# EAGLE design pixhawkDF13 (EAGLE 7.6.0)

## Sheet 1 of 2
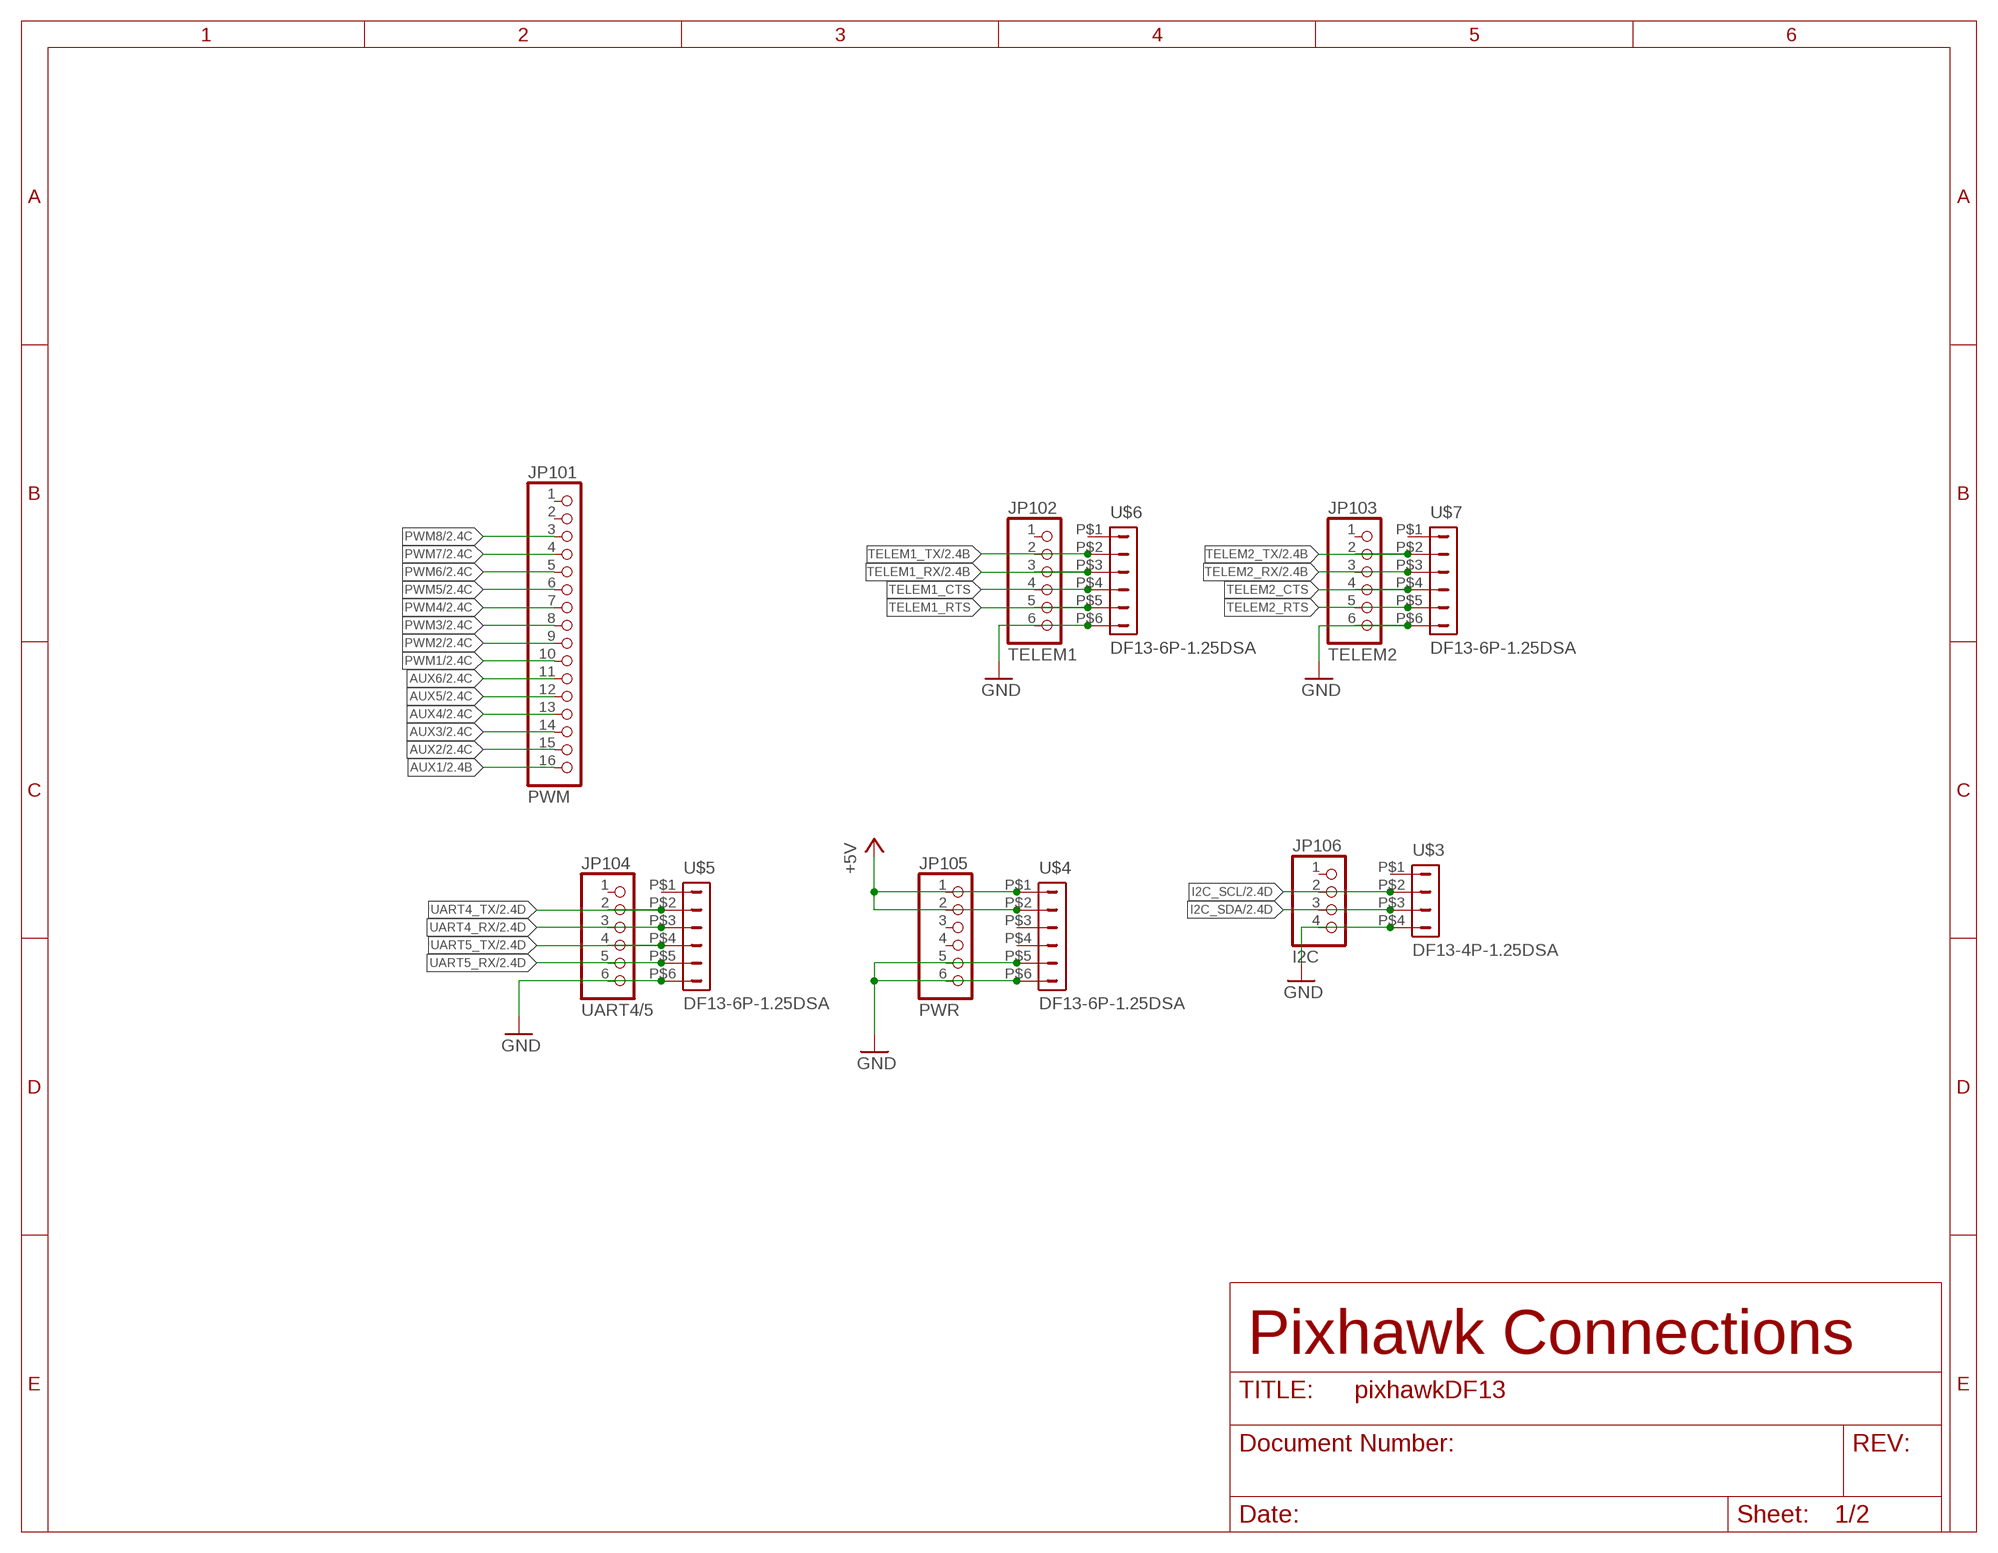
[diagram p0: schematic, sheet 1]

### Parts
JP101  PWM  PINHD-1X16  [1X16]
JP102  TELEM1  PINHD-1X6  [1X06]
JP103  TELEM2  PINHD-1X6  [1X06]
JP104  UART4/5  PINHD-1X6  [1X06]
JP105  PWR  PINHD-1X6  [1X06]
JP106  I2C  PINHD-1X4  [1X04]
U$3  DF13-4P-1.25DSA  [DF13-4P-1.25DSA]
U$4  DF13-6P-1.25DSA  [DF13-6P-1.25DSA]
U$5  DF13-6P-1.25DSA  [DF13-6P-1.25DSA]
U$6  DF13-6P-1.25DSA  [DF13-6P-1.25DSA]
U$7  DF13-6P-1.25DSA  [DF13-6P-1.25DSA]

### Nets
+5V: JP105.1 JP105.2 U$4.P$1 U$4.P$2 ; also sheet 2
AUX1: JP101.16 ; also sheet 2
AUX2: JP101.15 ; also sheet 2
AUX3: JP101.14 ; also sheet 2
AUX4: JP101.13 ; also sheet 2
AUX5: JP101.12 ; also sheet 2
AUX6: JP101.11 ; also sheet 2
GND: JP102.6 JP103.6 JP104.6 JP105.5 JP105.6 JP106.4 U$3.P$4 U$4.P$5 U$4.P$6 U$5.P$6 U$6.P$6 U$7.P$6 ; also sheet 2
I2C_SCL: JP106.2 U$3.P$2 ; also sheet 2
I2C_SDA: JP106.3 U$3.P$3 ; also sheet 2
PWM1: JP101.10 ; also sheet 2
PWM2: JP101.9 ; also sheet 2
PWM3: JP101.8 ; also sheet 2
PWM4: JP101.7 ; also sheet 2
PWM5: JP101.6 ; also sheet 2
PWM6: JP101.5 ; also sheet 2
PWM7: JP101.4 ; also sheet 2
PWM8: JP101.3 ; also sheet 2
TELEM1_CTS: JP102.4 U$6.P$4
TELEM1_RTS: JP102.5 U$6.P$5
TELEM1_RX: JP102.3 U$6.P$3 ; also sheet 2
TELEM1_TX: JP102.2 U$6.P$2 ; also sheet 2
TELEM2_CTS: JP103.4 U$7.P$4
TELEM2_RTS: JP103.5 U$7.P$5
TELEM2_RX: JP103.3 U$7.P$3 ; also sheet 2
TELEM2_TX: JP103.2 U$7.P$2 ; also sheet 2
UART4_RX: JP104.3 U$5.P$3 ; also sheet 2
UART4_TX: JP104.2 U$5.P$2 ; also sheet 2
UART5_RX: JP104.5 U$5.P$5 ; also sheet 2
UART5_TX: JP104.4 U$5.P$4 ; also sheet 2
Unconnected: JP101.1 JP101.2 JP102.1 JP103.1 JP104.1 JP105.3 JP105.4 JP106.1 U$3.P$1 U$4.P$3 U$4.P$4 U$5.P$1 U$6.P$1 U$7.P$1

### Notes on the sheet
- Pixhawk Connections

## Sheet 2 of 2
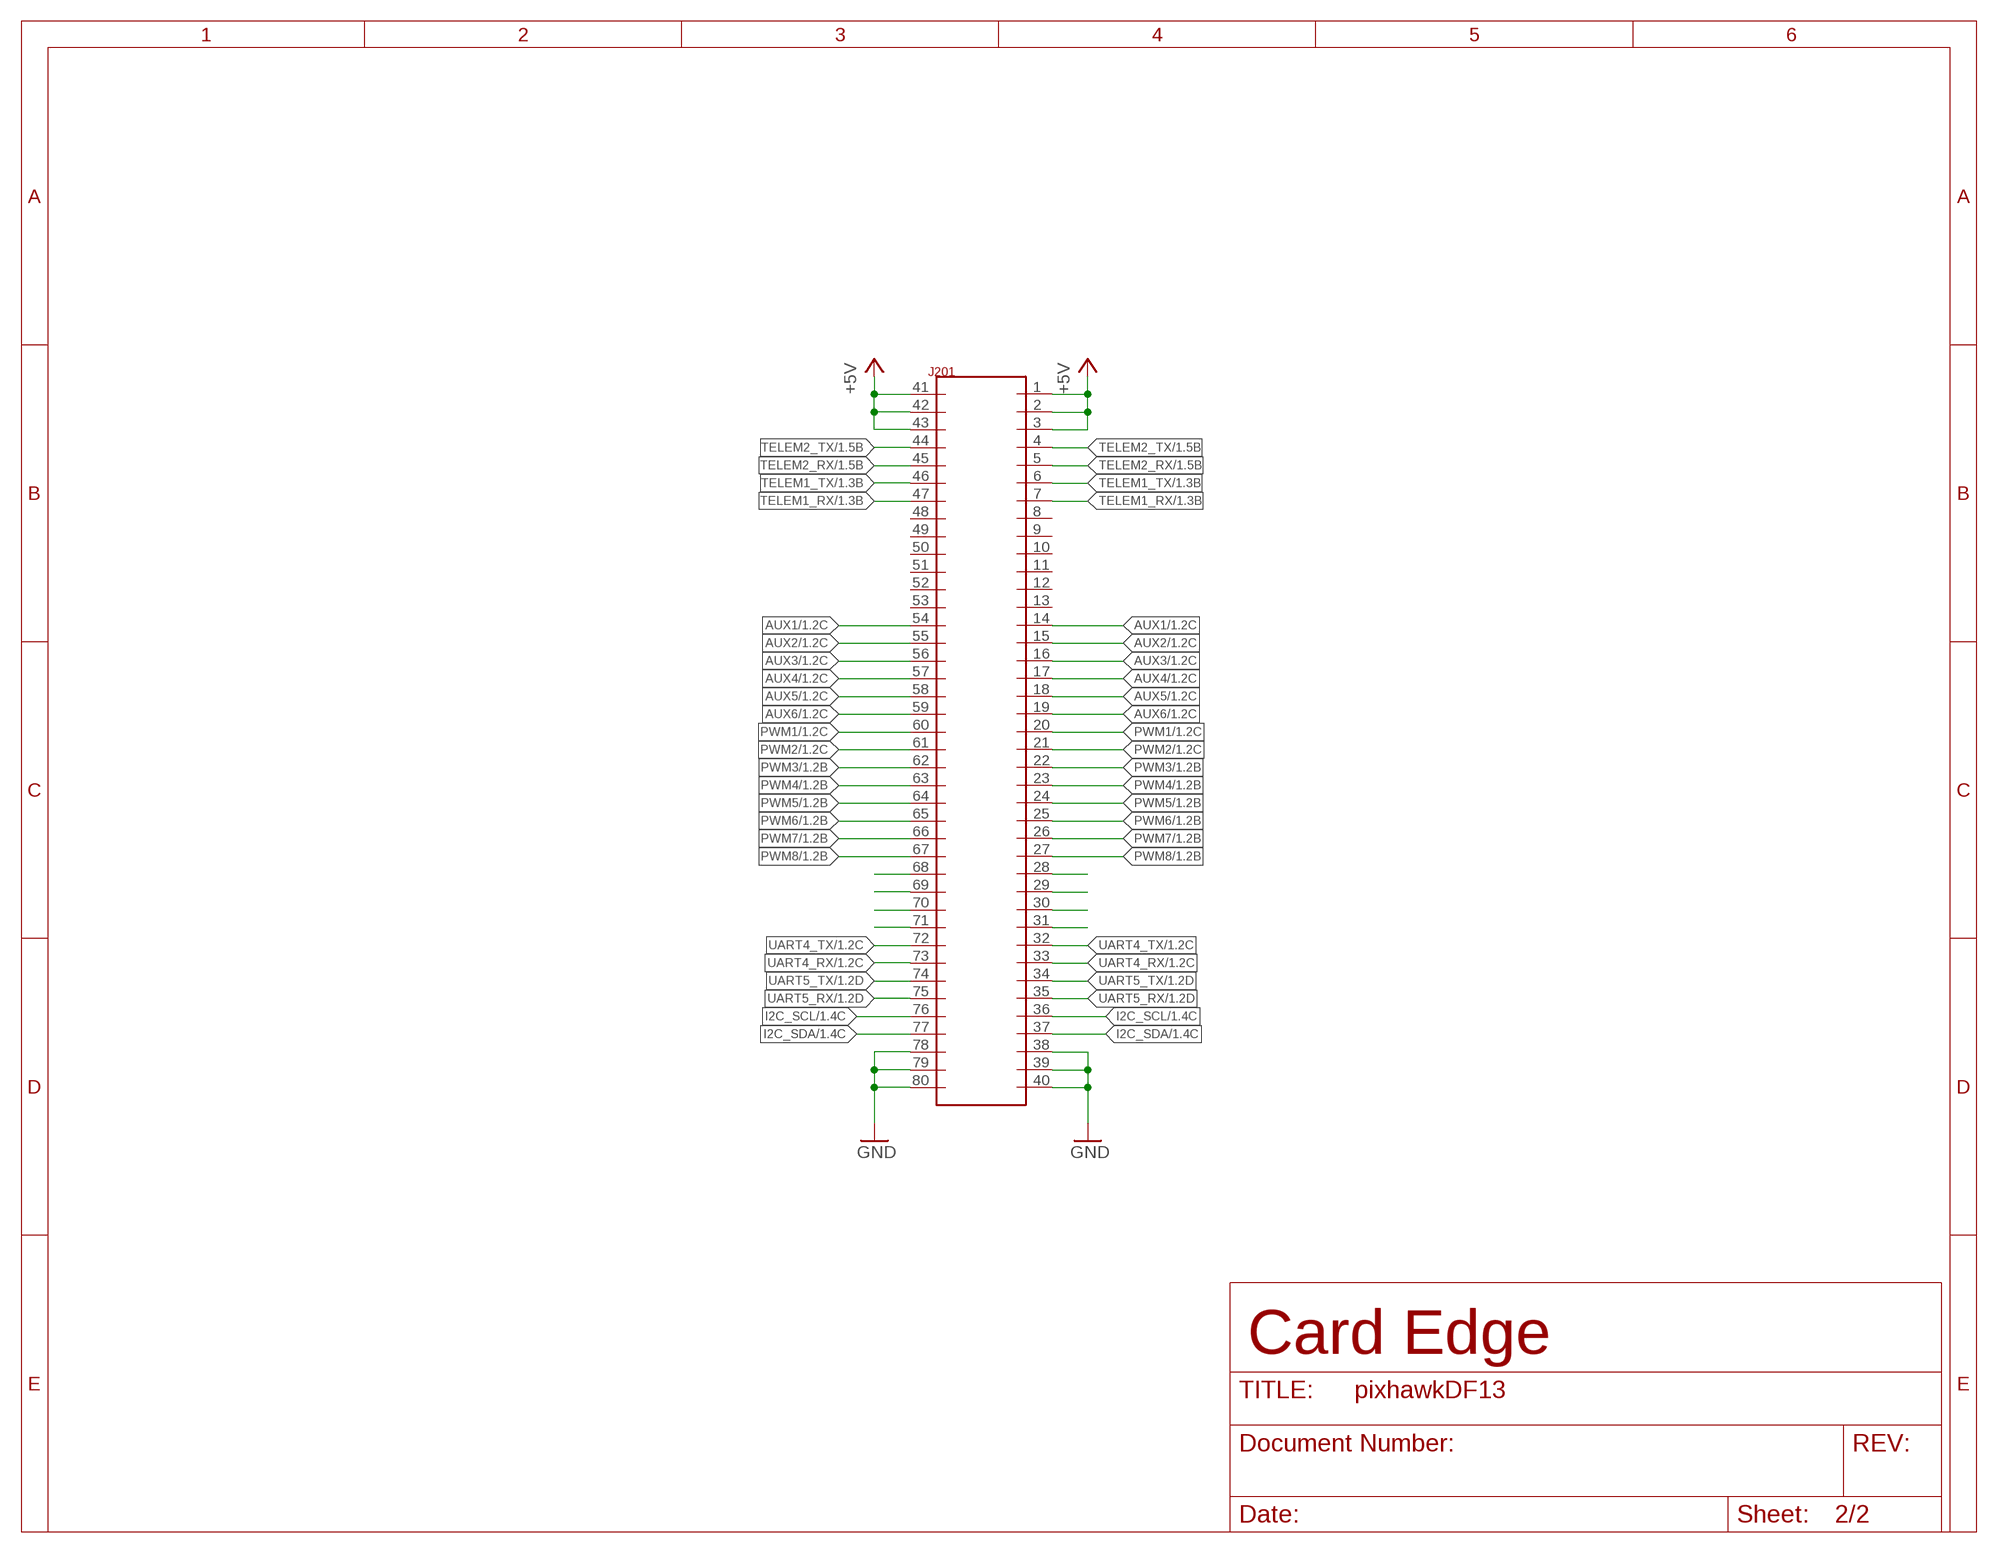
[diagram p1: schematic, sheet 2]

### Parts
J201  80-PIN-CARD-EDGE  [80-PIN-CARD-EDGE]

### Nets
+5V: J201.1 J201.2 J201.3 J201.41 J201.42 J201.43 ; also sheet 1
AUX1: J201.14 J201.54 ; also sheet 1
AUX2: J201.15 J201.55 ; also sheet 1
AUX3: J201.16 J201.56 ; also sheet 1
AUX4: J201.17 J201.57 ; also sheet 1
AUX5: J201.18 J201.58 ; also sheet 1
AUX6: J201.19 J201.59 ; also sheet 1
CAN_H: J201.30 J201.70
CAN_L: J201.31 J201.71
GND: J201.38 J201.39 J201.40 J201.78 J201.79 J201.80 ; also sheet 1
I2C_SCL: J201.36 J201.76 ; also sheet 1
I2C_SDA: J201.37 J201.77 ; also sheet 1
N$11: J201.28
N$12: J201.29
N$25: J201.69
N$26: J201.68
PWM1: J201.20 J201.60 ; also sheet 1
PWM2: J201.21 J201.61 ; also sheet 1
PWM3: J201.22 J201.62 ; also sheet 1
PWM4: J201.23 J201.63 ; also sheet 1
PWM5: J201.24 J201.64 ; also sheet 1
PWM6: J201.25 J201.65 ; also sheet 1
PWM7: J201.26 J201.66 ; also sheet 1
PWM8: J201.27 J201.67 ; also sheet 1
TELEM1_RX: J201.7 J201.47 ; also sheet 1
TELEM1_TX: J201.6 J201.46 ; also sheet 1
TELEM2_RX: J201.5 J201.45 ; also sheet 1
TELEM2_TX: J201.4 J201.44 ; also sheet 1
UART4_RX: J201.33 J201.73 ; also sheet 1
UART4_TX: J201.32 J201.72 ; also sheet 1
UART5_RX: J201.35 J201.75 ; also sheet 1
UART5_TX: J201.34 J201.74 ; also sheet 1
Unconnected: J201.8 J201.9 J201.10 J201.11 J201.12 J201.13 J201.48 J201.49 J201.50 J201.51 J201.52 J201.53

### Notes on the sheet
- Card Edge

## Library data of the parts
J201 = auv:80-PIN-CARD-EDGE
JP101 = auv:PINHD-1X16: PIN HEADER
JP102-JP105 = auv:PINHD-1X6: PIN HEADER
JP106 = auv:PINHD-1X4: PIN HEADER
U$3 = con-hirose-df13:DF13-4P-1.25: DF13-4P 1.25mm Pitch Miniature Crimping Connector.
U$4-U$7 = con-hirose-df13:DF13-6P-1.25: DF13-6P 1.25mm Pitch Miniature Crimping Connector.

## Board
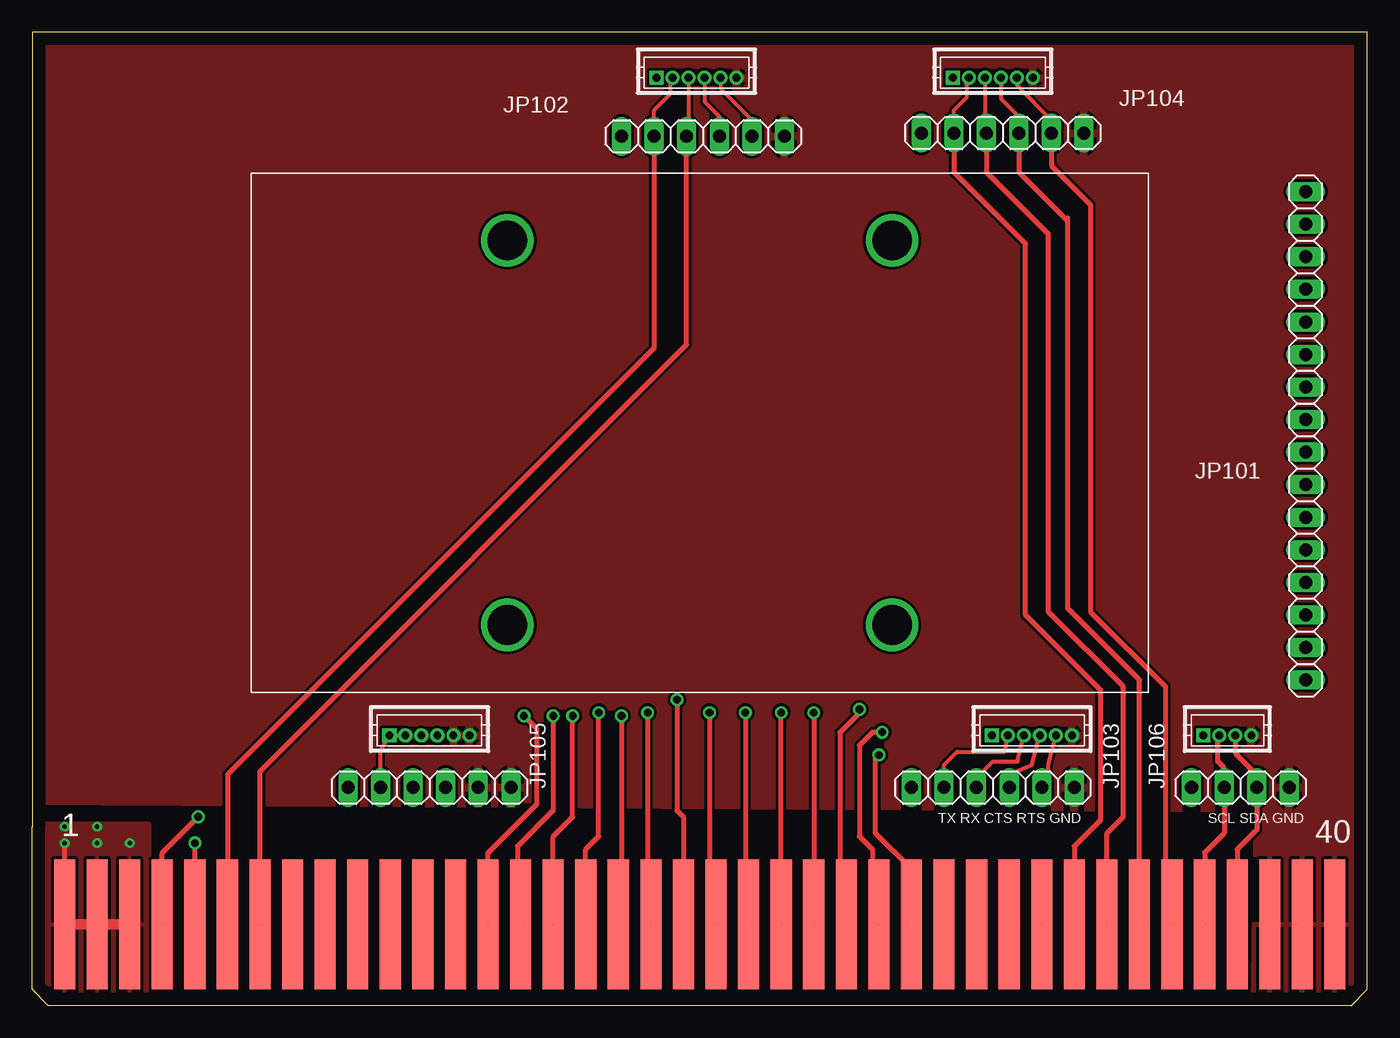
[diagram p2: board, top side]
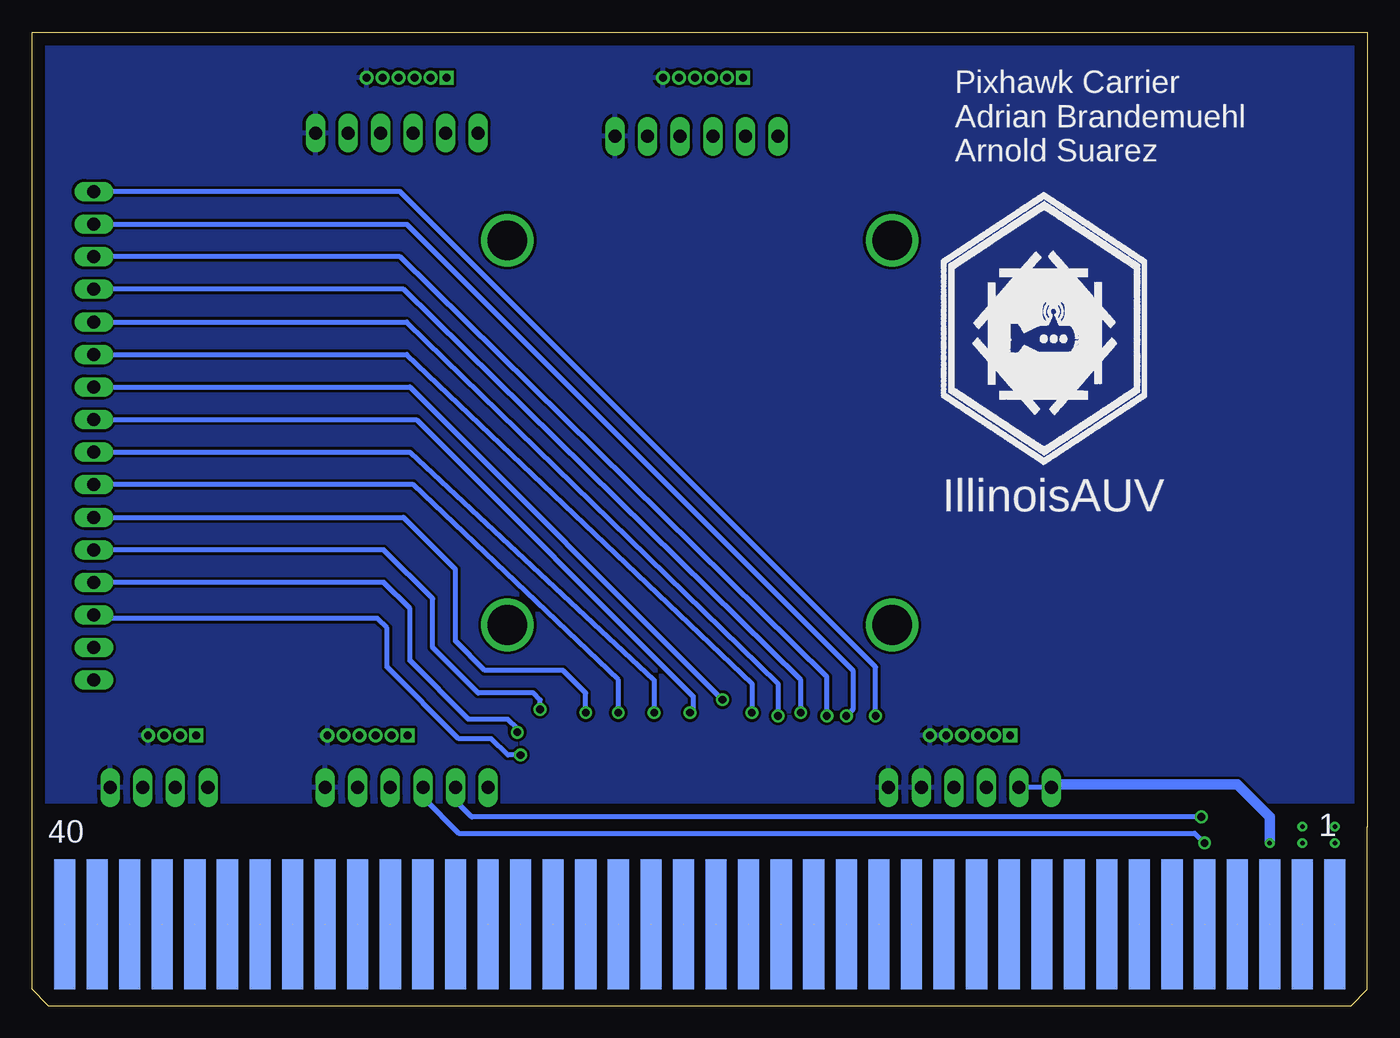
[diagram p3: board, bottom side, seen from below]

Size 104.14 x 75.95 mm. Coordinates in mm from the lower left corner, seen from the top.
Outline: 104.14,13.97 104.14,75.95 0,75.95 0,13.97
Copper layers (1*16): Top 0.035mm / dielectric 1.5mm / Bottom 0.035mm
Design rules "PCBway": minimum track width 6mil, minimum drill 0.3mm, track to track 0.205mm, track to pad 0.205mm, pad to pad 0.205mm, via to via 0.205mm, smd to smd 8mil, copper to edge 40mil, drill to drill 8mil, minimum pad ring 10mil, minimum via ring 8mil, stop-mask expansion 4mil, vias tented up to drill 25mil, thermal gap 10mil

### Footprints (pad centres in the part's own frame; a part is rotated, then mirrored left to right if it is on the bottom)
80-PIN-CARD-EDGE = smd 1.651 x 10.16: 1 -49.53,0; 2 -46.99,0; 3 -44.45,0; 4 -41.91,0; 5 -39.37,0; 6 -36.83,0; 7 -34.29,0; 8 -31.75,0; 9 -29.21,0; 10 -26.67,0; 11 -24.13,0; 12 -21.59,0; 13 -19.05,0; 14 -16.51,0; 15 -13.97,0; 16 -11.43,0; 17 -8.89,0; 18 -6.35,0; 19 -3.81,0; 20 -1.27,0; 21 1.27,0; 22 3.81,0; 23 6.35,0; 24 8.89,0; 25 11.43,0; 26 13.97,0; 27 16.51,0; 28 19.05,0; 29 21.59,0; 30 24.13,0; 31 26.67,0; 32 29.21,0; 33 31.75,0; 34 34.29,0; 35 36.83,0; 36 39.37,0; 37 41.91,0; 38 44.45,0; 39 46.99,0; 40 49.53,0 | smd 1.651 x 10.16 bottom: 41 -49.53,0; 42 -46.99,0; 43 -44.45,0; 44 -41.91,0; 45 -39.37,0; 46 -36.83,0; 47 -34.29,0; 48 -31.75,0; 49 -29.21,0; 50 -26.67,0; 51 -24.13,0; 52 -21.59,0; 53 -19.05,0; 54 -16.51,0; 55 -13.97,0; 56 -11.43,0; 57 -8.89,0; 58 -6.35,0; 59 -3.81,0; 60 -1.27,0; 61 1.27,0; 62 3.81,0; 63 6.35,0; 64 8.89,0; 65 11.43,0; 66 13.97,0; 67 16.51,0; 68 19.05,0; 69 21.59,0; 70 24.13,0; 71 26.67,0; 72 29.21,0; 73 31.75,0; 74 34.29,0; 75 36.83,0; 76 39.37,0; 77 41.91,0; 78 44.45,0; 79 46.99,0; 80 49.53,0
1X16 = drill 1.016 long: 1 -19.05,0; 2 -16.51,0; 3 -13.97,0; 4 -11.43,0; 5 -8.89,0; 6 -6.35,0; 7 -3.81,0; 8 -1.27,0; 9 1.27,0; 10 3.81,0; 11 6.35,0; 12 8.89,0; 13 11.43,0; 14 13.97,0; 15 16.51,0; 16 19.05,0
1X06 = drill 1.016 long: 1 -6.35,0; 2 -3.81,0; 3 -1.27,0; 4 1.27,0; 5 3.81,0; 6 6.35,0
1X04 = drill 1.016 long: 1 -3.81,0; 2 -1.27,0; 3 1.27,0; 4 3.81,0
PIXHAWK_MOUNTING_HOLES = drill 3.1: P$1 -15,-15; P$2 -15,15; P$3 15,15; P$4 15,-15
DF13-4P-1.25DSA = drill 0.6 pad 1.016 square: P$1 1.875,0 | drill 0.6 pad 1.016: P$2 0.625,0; P$3 -0.625,0; P$4 -1.875,0
DF13-6P-1.25DSA = drill 0.6 pad 1.016 square: P$1 3.125,0 | drill 0.6 pad 1.016: P$2 1.875,0; P$3 0.625,0; P$4 -0.625,0; P$5 -1.875,0; P$6 -3.125,0

### Placement (x,y rotation side)
J201  52.07,6.35 0 top
JP101  99.31,44.45 90 top
JP102  52.32,67.82 0 top
JP103  74.93,17.02 0 top
JP104  75.69,68.07 0 top
JP105  30.99,17.02 0 top
JP106  94.23,17.02 0 top
U$1  PIXHAWK_MOUNTING_HOLES  [PIXHAWK_MOUNTING_HOLES]  52.07,44.7 180 top
U$2  ILLINOISAUV  [ILLINOISAUV]  24.26,51.26 0 bottom
U$3  93.22,21.08 180 top
U$4  30.99,21.08 180 top
U$5  74.93,72.39 180 top
U$6  51.82,72.39 180 top
U$7  77.98,21.08 180 top

### Tracks (layer width: path | path; a pad name or v marks a point on that pad's centre or on a via)
+5V  (via drill 0.35)  (3 unrouted)
  Top 0.305: JP105.2 27.18,19.89 U$4.P$1 U$4.P$2
  Top 0.406: J201.1 v2.54,12.7
  Top 0.813: J201.3 J201.2 J201.1
  Bottom 0.406: JP105.1 JP105.2
  Bottom 0.813: v7.62,12.7 7.62,14.73 10.16,17.27 24.38,17.27 JP105.1
  other vias: 2.54,13.97 5.08,12.7 5.08,13.97
  pour Top: -3.3,14.22 9.14,14.22 9.14,-1.52 -3.3,-1.52
AUX1  (via drill 0.6)  (1 unrouted)
  Top 0.406: J201.54 35.56,11.94 39.37,15.75 39.37,21.59 v38.35,22.61
  Bottom 0.406: v38.35,22.61 38.35,26.42 75.44,63.5 JP101.16
AUX2  (via drill 0.6)  (1 unrouted)
  Top 0.406: v40.64,22.61 40.64,15.24 37.85,12.45 37.85,6.6 J201.55
  Bottom 0.406: JP101.15 74.93,60.96 40.13,26.16 40.13,23.11 v40.64,22.61
AUX3  (via drill 0.6)  (1 unrouted)
  Top 0.406: J201.56 40.64,13.21 42.16,14.73 v42.16,22.61
  Bottom 0.406: v42.16,22.61 42.16,25.65 75.44,58.42 JP101.14
AUX4  (via drill 0.6)  (1 unrouted)
  Top 0.406: J201.57 43.18,12.19 44.2,13.21 v44.2,22.86
  Bottom 0.406: v44.2,22.86 44.2,25.4 75.18,55.88 JP101.13
AUX5  (via drill 0.6)  (1 unrouted)
  Top 0.406: v45.97,22.61 45.97,6.6 J201.58
  Bottom 0.406: JP101.12 74.93,53.34 45.97,25.15 v45.97,22.61
AUX6  (via drill 0.6)  (1 unrouted)
  Top 0.406: v48.01,22.86 48.01,6.6 J201.59
  Bottom 0.406: JP101.11 74.93,50.8 48.01,25.15 v48.01,22.86
CAN_H  (1 unrouted)
CAN_L  (1 unrouted)
GND  (3 unrouted)
  pour Bottom: -4.32,79.76 108.71,79.76 108.71,16 -4.32,16
  pour Top: -6.86,82.04 111.51,82.3 111.51,15.24 -7.11,16
  pour Top: 106.43,-0.76 95.25,-0.76 95.5,18.54 106.68,18.54
I2C_SCL  (1 unrouted)
  Top 0.406: J201.76 91.44,11.94 92.96,13.46 JP106.2 92.96,18.54 92.46,19.05 92.46,20.69 U$3.P$2
I2C_SDA  (1 unrouted)
  Top 0.406: J201.77 93.98,12.19 95.5,13.72 JP106.3 95.25,17.27 95.25,18.29 93.84,19.7 U$3.P$3
PWM1  (via drill 0.6)  (1 unrouted)
  Top 0.406: v50.29,23.88 50.29,15.24 50.8,14.73 J201.60
  Bottom 0.406: JP101.10 74.68,48.26 v50.29,23.88
PWM2  (via drill 0.6)  (1 unrouted)
  Top 0.406: v52.83,22.86 52.83,6.86 J201.61
  Bottom 0.406: JP101.9 74.17,45.72 52.58,24.13 52.58,23.11 v52.83,22.86
PWM3  (via drill 0.6)  (1 unrouted)
  Top 0.406: v55.63,22.86 55.63,6.6 J201.62
  Bottom 0.406: JP101.8 74.68,43.18 55.63,25.4 v55.63,22.86
PWM4  (via drill 0.6)  (1 unrouted)
  Top 0.406: J201.63 v58.42,22.86
  Bottom 0.406: v58.42,22.86 58.42,25.4 74.42,40.64 JP101.7
PWM5  (via drill 0.6)  (1 unrouted)
  Top 0.406: v60.96,22.86 J201.64
  Bottom 0.406: JP101.6 75.18,38.1 71.12,34.04 71.12,28.45 68.83,26.16 62.74,26.16 60.96,24.38 v60.96,22.86
PWM6  (via drill 0.6)  (1 unrouted)
  Top 0.406: v64.52,23.11 64.52,22.86 62.99,21.34 62.99,6.86 J201.65
  Bottom 0.406: JP101.5 76.71,35.56 72.9,31.75 72.9,27.94 69.34,24.38 65.02,24.38 64.52,23.88 v64.52,23.11
PWM7  (via drill 0.6)  (1 unrouted)
  Top 0.406: v66.29,21.34 65.53,21.34 64.52,20.32 64.52,13.21 65.53,12.19 65.53,6.86 J201.66
  Bottom 0.406: JP101.4 76.71,33.02 74.68,30.99 74.68,26.92 70.1,22.35 67.06,22.35 66.29,21.59 v66.29,21.34
PWM8  (via drill 0.6)  (1 unrouted)
  Top 0.406: J201.67 68.58,10.67 65.79,13.46 65.79,19.3 v66.04,19.56
  Bottom 0.406: v66.04,19.56 67.06,19.56 68.33,20.83 70.87,20.83 76.45,26.42 76.45,29.46 77.22,30.23 99.06,30.23 JP101.3
TELEM1_CTS
  Top 0.305: U$6.P$4 52.44,70.5 53.59,69.34 JP102.4
TELEM1_RTS
  Top 0.305: U$6.P$5 53.69,71.53 56.13,69.09 JP102.5
TELEM1_RX  (1 unrouted)
  Top 0.305: U$6.P$3 51.19,67.95 JP102.3
  Top 0.406: J201.47 17.78,18.29 51.05,51.56 JP102.3
TELEM1_TX  (1 unrouted)
  Top 0.305: JP102.2 48.51,69.85 49.78,71.12 49.78,72.23 U$6.P$2
  Top 0.406: JP102.2 48.51,51.31 15.24,18.03 J201.46
TELEM2_CTS
  Top 0.305: JP103.4 76.2,18.03 77.98,18.8 78.49,20.71 U$7.P$4
TELEM2_RTS
  Top 0.305: JP103.5 79.25,18.29 79.25,18.8 79.76,20.73 U$7.P$5
TELEM2_RX  (via drill 0.6)  (1 unrouted)
  Top 0.305: JP103.3 73.66,17.78 74.93,19.05 76.84,19.05 U$7.P$3
  Top 0.406: v12.7,12.7 J201.45
  Bottom 0.406: v12.7,12.7 13.46,13.46 70.87,13.46 73.66,16.26 JP103.3
TELEM2_TX  (via drill 0.6)  (1 unrouted)
  Top 0.305: JP103.2 71.12,18.8 72.14,19.81 75.85,19.81 U$7.P$2
  Top 0.406: J201.44 10.16,11.94 v12.95,14.73
  Bottom 0.406: v12.95,14.73 69.85,14.73 71.12,16 JP103.2
UART4_RX  (1 unrouted)
  Top 0.305: U$5.P$3 74.31,68.19 JP104.3
  Top 0.406: JP104.3 74.42,65.02 79.25,60.2 79.25,30.73 85.09,24.89 85.09,14.73 83.82,13.46 J201.73
UART4_TX  (1 unrouted)
  Top 0.305: JP104.2 71.88,69.85 72.9,70.87 72.9,72.23 U$5.P$2
  Top 0.406: JP104.2 71.88,65.02 77.47,59.44 77.47,30.48 83.31,24.64 83.31,14.48 81.28,12.45 J201.72
UART5_RX  (1 unrouted)
  Top 0.305: U$5.P$5 76.81,71.78 79.5,69.09 JP104.5
  Top 0.406: JP104.5 79.5,65.53 82.55,62.48 82.55,30.73 88.39,24.89 88.39,6.86 J201.75
UART5_TX  (1 unrouted)
  Top 0.305: U$5.P$4 75.56,70.75 76.96,69.34 JP104.4
  Top 0.406: 80.77,61.21 80.77,30.99 86.36,25.4 J201.74 | 80.77,61.21 80.77,61.47 | JP104.4 76.96,65.02 80.77,61.21

### Text on the board
tNames: TX RX CTS RTS GND | SCL SDA GND | 1 | 40
bNames: Pixhawk Carrier / Adrian Brandemuehl / Arnold Suarez | 1 | 40